# EAGLE schematic Rov3_zasilanie (EAGLE 9.4.1)
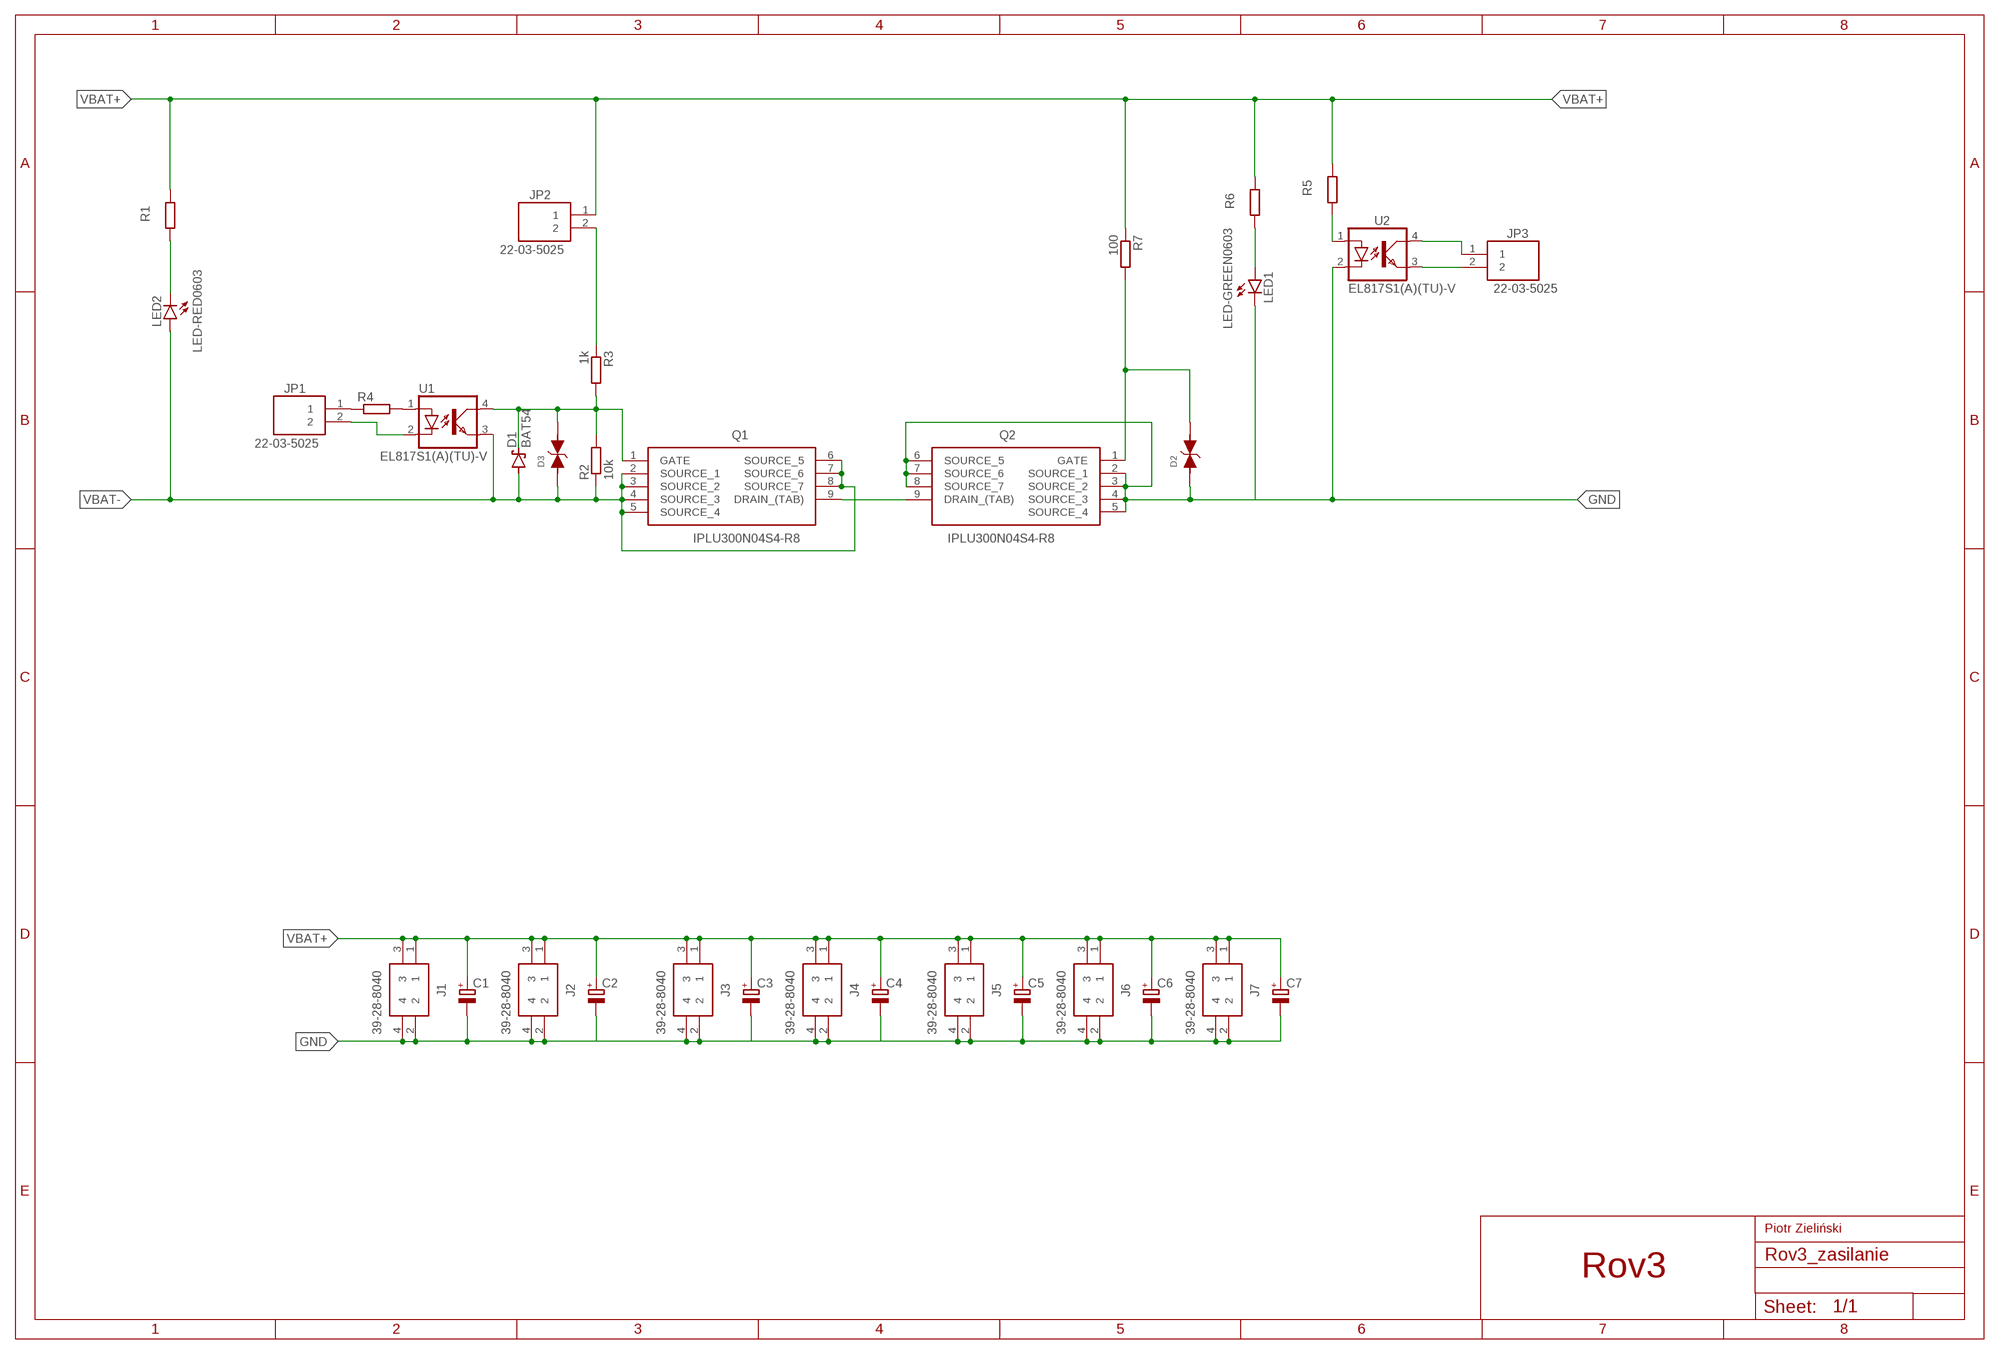
[diagram p0: schematic, sheet 1]

## Parts
C1  CPOL-EUE5-10.5  [E5-10,5]
C2  CPOL-EUE5-10.5  [E5-10,5]
C3  CPOL-EUE5-10.5  [E5-10,5]
C4  CPOL-EUE5-10.5  [E5-10,5]
C5  CPOL-EUE5-10.5  [E5-10,5]
C6  CPOL-EUE5-10.5  [E5-10,5]
C7  CPOL-EUE5-10.5  [E5-10,5]
D1  BAT54  [SOT23]
D2  WE-TVSP_BI_400W_824501221  [VARTVSP_SMA/DO-214AC]
D3  WE-TVSP_BI_400W_824501221  [VARTVSP_SMA/DO-214AC]
J1  39-28-8040  [MOLEX_2X2_PCB_SOCKET]
J2  39-28-8040  [MOLEX_2X2_PCB_SOCKET]
J3  39-28-8040  [MOLEX_2X2_PCB_SOCKET]
J4  39-28-8040  [MOLEX_2X2_PCB_SOCKET]
J5  39-28-8040  [MOLEX_2X2_PCB_SOCKET]
J6  39-28-8040  [MOLEX_2X2_PCB_SOCKET]
J7  39-28-8040  [MOLEX_2X2_PCB_SOCKET]
JP1  22-03-5025  [2.50MM_MINI-SPOX_2PIN_PCB_SOCKET]
JP2  22-03-5025  [2.50MM_MINI-SPOX_2PIN_PCB_SOCKET]
JP3  22-03-5025  [2.50MM_MINI-SPOX_2PIN_PCB_SOCKET]
LED1  LED-GREEN0603  [0603-GREEN]
LED2  LED-RED0603  [0603-RED]
Q1  IPLU300N04S4-R8  [PG-HSOF-8-1]
Q2  IPLU300N04S4-R8  [PG-HSOF-8-1]
R1  R-EU_R0805  [R0805]
R2  10k  R-EU_R0805  [R0805]
R3  1k  R-EU_R0805  [R0805]
R4  R-EU_R0805  [R0805]
R5  R-EU_R0805  [R0805]
R6  R-EU_R0805  [R0805]
R7  100  R-EU_R0805  [R0805]
U1  EL817S1(A)(TU)-V  [SOIC254P1030X390-4N_EL817S1(A)(TU)-V]
U2  EL817S1(A)(TU)-V  [SOIC254P1030X390-4N_EL817S1(A)(TU)-V]

## Nets
GND: C1.- C2.- C3.- C4.- C5.- C6.- C7.- D2.1 J1.2 J1.4 J2.2 J2.4 J3.2 J3.4 J4.2 J4.4 J5.2 J5.4 J6.2 J6.4 J7.2 J7.4 LED1.C Q2.2(SOURCE_1) Q2.3(SOURCE_2) Q2.4(SOURCE_3) Q2.5(SOURCE_4) Q2.6(SOURCE_5) Q2.7(SOURCE_6) Q2.8(SOURCE_7) U2.2(C)
N$1 [signal]: LED1.A R6.1
N$2: Q1.9(DRAIN_(TAB)) Q2.9(DRAIN_(TAB))
N$3 [signal]: JP1.1 R4.1
N$4 [signal]: D1.3(C) D3.2 Q1.1(GATE) R2.2 R3.2 U1.4(COL)
N$5 [signal]: JP1.2 U1.2(C)
N$6 [signal]: R4.2 U1.1(A)
N$7 [signal]: JP2.2 R3.1
N$8 [signal]: JP3.2 U2.3(EMIT)
N$9 [signal]: JP3.1 U2.4(COL)
N$10 [signal]: R5.1 U2.1(A)
N$11: LED2.C R1.1
N$15 [signal]: D2.2 Q2.1(GATE) R7.2
VBAT+: C1.+ C2.+ C3.+ C4.+ C5.+ C6.+ C7.+ J1.1 J1.3 J2.1 J2.3 J3.1 J3.3 J4.1 J4.3 J5.1 J5.3 J6.1 J6.3 J7.1 J7.3 JP2.1 R1.2 R5.2 R6.2 R7.1
VBAT-: D1.1(A) D3.1 LED2.A Q1.2(SOURCE_1) Q1.3(SOURCE_2) Q1.4(SOURCE_3) Q1.5(SOURCE_4) Q1.6(SOURCE_5) Q1.7(SOURCE_6) Q1.8(SOURCE_7) R2.1 U1.3(EMIT)

## Notes on the sheet
- Piotr Zieliński
- Rov3

## Library data of the parts
C1-C7 = rcl:CPOL-EU: POLARIZED CAPACITOR, European symbol; SPICEPREFIX: C
D1 = diode:BAT54: Schottky Diodes Source: Fairchild .. BAT54.pdf
D2 D3 = PowerMagnetics (rev18e):WE-TVSP_BI_400W: WE-TVSP Power TVS Diode <http://katalog.we-online.de/media/images/v2/WE-TVSP_600W-3000W_D0214AA_4C.jpg> Details see: http://katalog.we-online.de/en/pbs/WE-TVSP/824500101 2015 (C) Würth Elektronik
J1-J7 = SamacSys_Parts:39-28-8040: Molex Mini-Fit Jr 5566, 4.2mm Pitch, 4 Way, 2 Row Male PCB Header Source: Datasheet <https://componentsearchengine.com/Datasheets/1/39-28-8040.pdf>; DESCRIPTION: Molex Mini-Fit Jr 5566, 4.2mm Pitch, 4 Way, 2 Row Male PCB Header; HEIGHT: 13.1mm; MANUFACTURER_NAME: Molex; MANUFACTURER_PART_NUMBER: 39-28-8040; MOUSER_PART_NUMBER: 538-39-28-8040; MOUSER_PRICE-STOCK: https://www.mouser.com/Search/Refine.aspx?Keyword=538-39-28-8040
JP1-JP3 = SamacSys_Parts:22-03-5025: Header 2.5mm SPOX,WTB,vert, shrouded, 2w Molex SPOX Series, Series Number 5267, 2.5mm Pitch 2 Way 1 Row Straight PCB Header, Solder Termination Source: Datasheet <https://componentsearchengine.com/Datasheets/1/22-03-5025.pdf>; DESCRIPTION: Header 2.5mm SPOX,WTB,vert, shrouded, 2w Molex SPOX Series, Series Number 5267, 2.5mm Pitch 2 Way 1 Row Straight PCB Header, Solder Termination; HEIGHT: 5.9mm; MANUFACTURER_NAME: Molex; MANUFACTURER_PART_NUMBER: 22-03-5025; MOUSER_PART_NUMBER: 538-22-03-5025; MOUSER_PRICE-STOCK: https://www.mouser.com/Search/Refine.aspx?Keyword=538-22-03-5025
LED1 = BeagleBone_Blue_R3:LED-GREEN
LED2 = BeagleBone_Blue_R3:LED-RED
Q1 Q2 = SamacSys_Parts:IPLU300N04S4-R8: MOSFET N-CHANNEL 30/40V Source: Datasheet <https://componentsearchengine.com/Datasheets/1/IPLU300N04S4-R8.pdf>; DESCRIPTION: MOSFET N-CHANNEL 30/40V; HEIGHT: mm; MANUFACTURER_NAME: Infineon; MANUFACTURER_PART_NUMBER: IPLU300N04S4-R8; MOUSER_PART_NUMBER: 726-IPLU300N04S4-R8; MOUSER_PRICE-STOCK: https://www.mouser.com/Search/Refine.aspx?Keyword=726-IPLU300N04S4-R8
R1-R7 = rcl:R-EU_: RESISTOR, European symbol; SPICEPREFIX: R
U1 U2 = SamacSys_Parts:EL817S1(A)(TU)-V: Optoisoltr 5kv Transistor 4-Smd; AVAILABILITY: Unavailable; DESCRIPTION: Optoisoltr 5kv Transistor 4-Smd; MF: Everlight Electronics; MP: EL817S1_A__TU_-V; PACKAGE: SMD-4 Everlight Electronics; PRICE: None

## Net classes
0 supply: width 0.5 mm, clearance 0.2 mm
1 signal: width 0.4 mm, drill 0.4 mm, clearance 0.2 mm